# EAGLE design f394 (EAGLE 7.5.1)
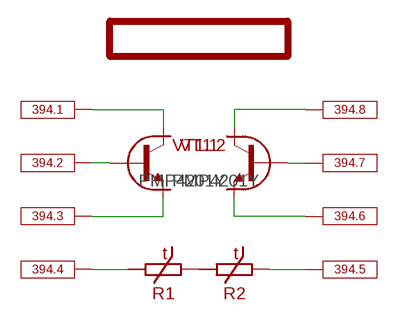
[diagram p0: schematic, sheet 1]

## Parts
394  DIP8  [BA3760X8]
R1  ERA-V33J102V  [R-0603]
R2  ERA-V33J102V  [R-0603]
VT1  PMP4201Y  [SOT363_PHILIPS]

## Nets
B1: 394.B2(.2:PIN) 394.T2(.2:PIN) VT1.1(.1:B)
B2: 394.B7(.7:PIN) 394.T7(.7:PIN) VT1.2(.2:B)
N$1: 394.B1(.1:PIN) 394.T1(.1:PIN) VT1.6(.1:C)
N$3: 394.B6(.6:PIN) 394.T6(.6:PIN) VT1.4(.2:E)
N$4: 394.B8(.8:PIN) 394.T8(.8:PIN) VT1.3(.2:C)
N$6: 394.B3(.3:PIN) 394.T3(.3:PIN) VT1.5(.1:E)
N$7: R1.2(E) R2.1(A)
N$9: 394.B4(.4:PIN) 394.T4(.4:PIN) R1.1(A)
N$10: 394.B5(.5:PIN) 394.T5(.5:PIN) R2.2(E)

## Library data of the parts
394 = module-footprints:DIP8
R1 R2 = resistors:ERA-?33J*V
VT1 = transistors-npn:PMP4201Y

## Board
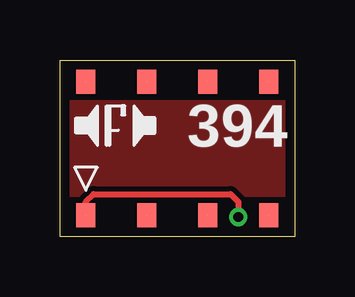
[diagram p1: board, top side]
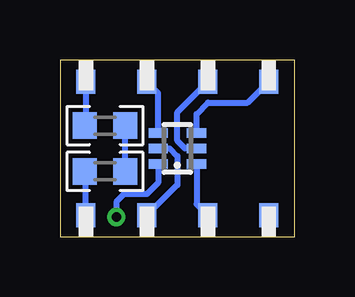
[diagram p2: board, bottom side, seen from below]

Size 9.78 x 7.37 mm. Coordinates in mm from the lower left corner, seen from the top.
Copper layers (1*16): Top 0.0356mm / dielectric 1.5011mm / Bottom 0.0356mm
Design rules "sonictrain": minimum track width 6mil, minimum drill 13mil, track to track 8mil, track to pad 8mil, pad to pad 6mil, via to via 6mil, smd to smd 6mil, copper to edge 15mil, drill to drill 6mil, minimum pad ring 7mil, minimum via ring 7mil, stop-mask expansion 3mil, vias tented up to drill 25mil, thermal gap 10mil

### Footprints (pad centres in the part's own frame; a part is rotated, then mirrored left to right if it is on the bottom)
BA3760X8 = smd 0.8 x 1 bottom: B1 1.27,1.025; B2 3.81,1.025; B3 6.35,1.025; B4 8.89,1.025; B5 8.89,6.595; B6 6.35,6.595; B7 3.81,6.595; B8 1.27,6.595 | smd 0.8 x 1: T1 1.27,1.025; T2 3.81,1.025; T3 6.35,1.025; T4 8.89,1.025; T5 8.89,6.595; T6 6.35,6.595; T7 3.81,6.595; T8 1.27,6.595
R-0603 = smd 1 x 1.1: 1 -0.85,0; 2 0.85,0
SOT363_PHILIPS = smd 0.4 x 0.8: 1 -0.65,-0.8; 2 0,-0.8; 3 0.65,-0.8; 4 0.65,0.8; 5 0,0.8; 6 -0.65,0.8

### Placement (x,y rotation side)
394  -0.19,-0.12 0 top
R1  7.91,2.73 0 bottom
R2  7.91,4.64 180 bottom
VT1  4.89,3.69 90 bottom

### Tracks (layer width: path | path; a pad name or v marks a point on that pad's centre or on a via)
B1  (1 unrouted)
  Bottom 0.254: VT1.1 4.09,1.37 394.T2
B2  (1 unrouted)
  Bottom 0.254: 394.B7 4.89,5.2 4.89,4 4.57,3.69 VT1.2
N$1  (via drill 0.4)  (1 unrouted)
  Top 0.254: 394.T1 1.08,1.46 1.4,1.78 7.11,1.78 7.43,1.46 v7.43,0.83
  Bottom 0.254: VT1.6 5.69,2.25 6.16,1.78 7.11,1.78 7.43,1.46 v7.43,0.83
N$3  (1 unrouted)
  Bottom 0.254: VT1.4 5.69,6 394.T6
N$4  (1 unrouted)
  Bottom 0.254: VT1.3 4.09,5.12 3.62,5.59 1.96,5.59 394.T8
N$6  (1 unrouted)
  Bottom 0.254: 394.T3 4.89,2.17 4.89,3.37 5.21,3.69 VT1.5
N$7
  Bottom 0.254: R1.2 R2.1
N$8
  pour Top: 0.13,5.59 9.65,5.59 9.65,1.78 0.13,1.78
N$9  (1 unrouted)
  Bottom 0.254: 394.B4 8.7,2.68 R1.1
N$10  (1 unrouted)
  Bottom 0.254: 394.T5 8.7,4.38 R2.2